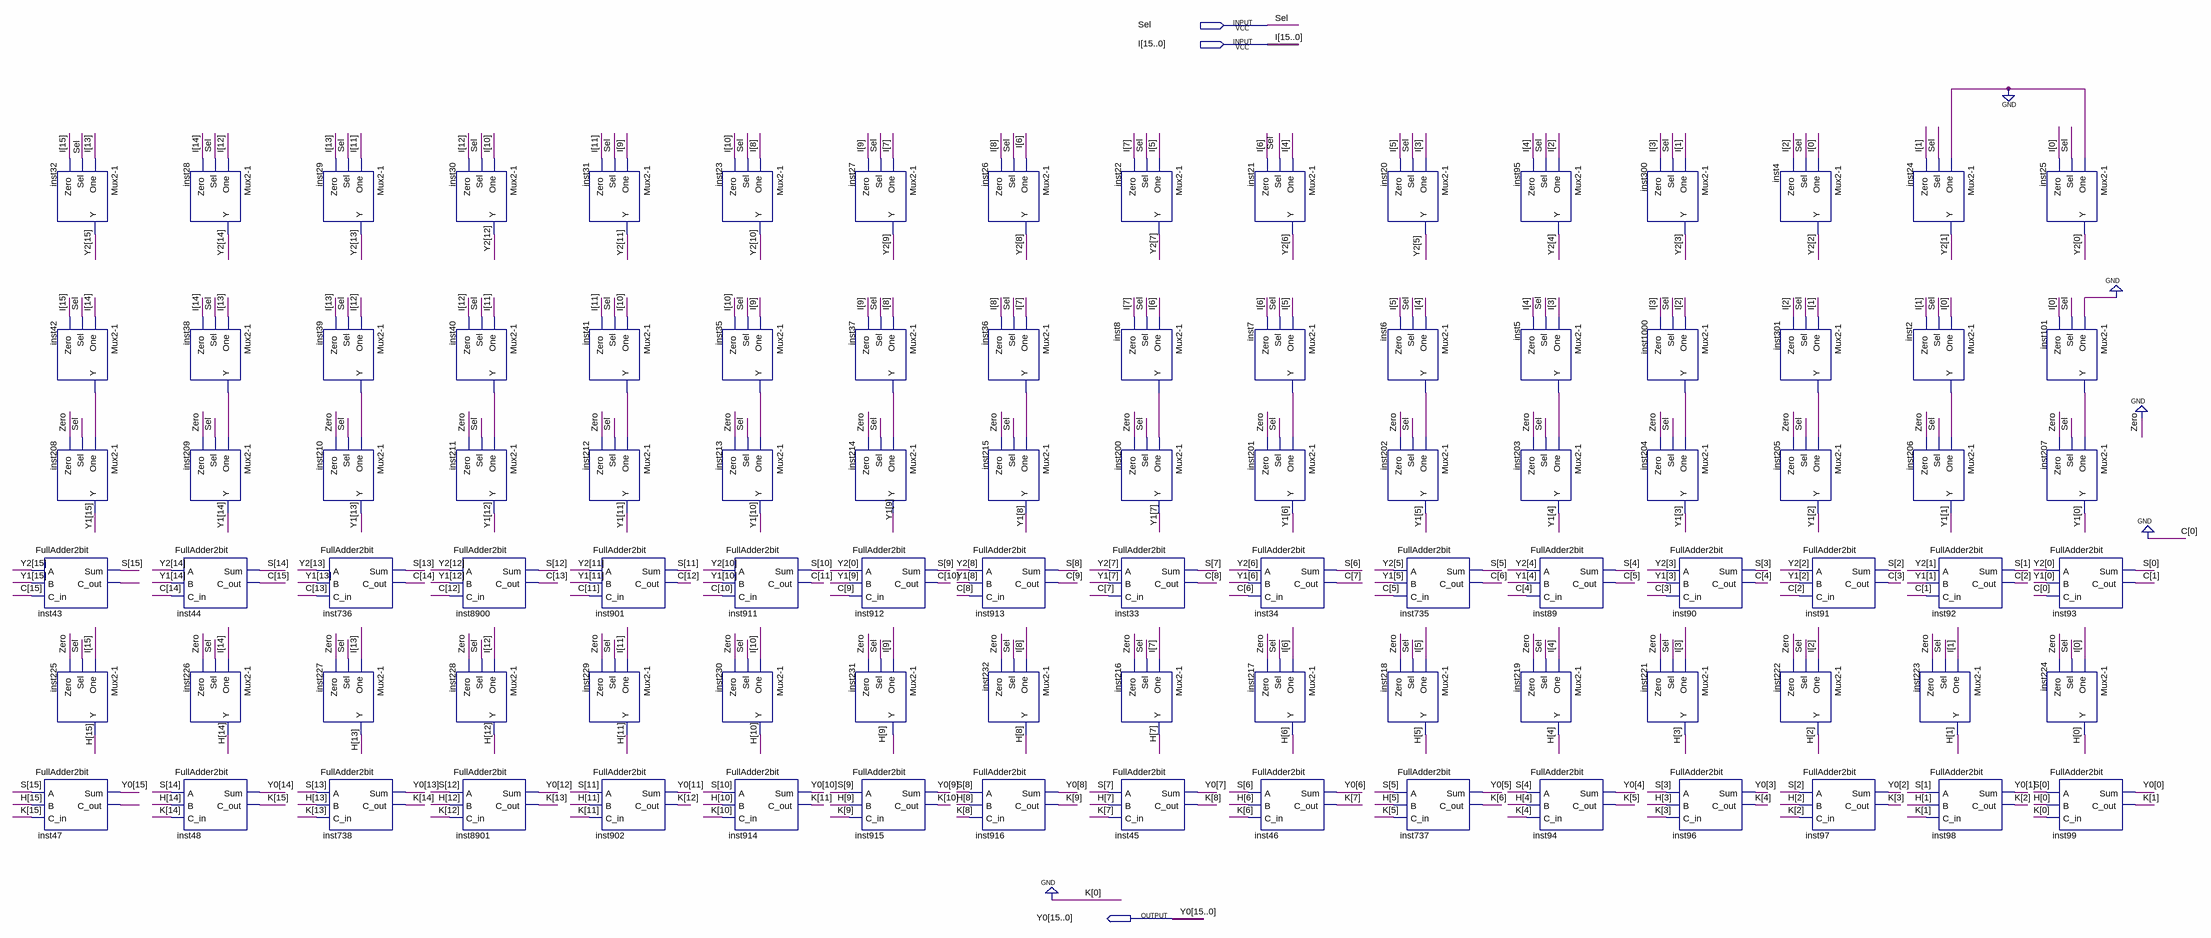
[diagram p0: schematic sheet]
// Quartus schematic ShifterX7.bdf as structural Verilog: 96 symbols, 3 pins
module ShifterX7 (
  input  Sel,
  input  [15:0] I,
  output [15:0] Y0
);

  wire inst2_y, inst5_y, inst6_y, inst7_y, inst8_y, inst35_y, inst36_y, inst37_y, inst38_y, inst39_y,
       inst40_y, inst41_y, inst42_y, inst43_c_out, inst47_c_out, inst101_y, inst301_y, inst1000_y;
  wire [15:0] H, S, Y1, Y2;
  wire [15:1] C, K;

  FullAdder2bit inst43 (.A(Y2[15]), .B(Y1[15]), .C_in(C[15]), .Sum(S[15]), .C_out(inst43_c_out));
  FullAdder2bit inst47 (.A(S[15]), .B(H[15]), .C_in(K[15]), .Sum(Y0[15]), .C_out(inst47_c_out));
  \Mux2-1  inst32 (.One(I[13]), .Sel(Sel), .Zero(I[15]), .Y(Y2[15]));
  \Mux2-1  inst42 (.One(I[14]), .Sel(Sel), .Zero(I[15]), .Y(inst42_y));
  \Mux2-1  inst208 (.One(inst42_y), .Sel(Sel), .Zero(1'b0), .Y(Y1[15]));
  \Mux2-1  inst225 (.One(I[15]), .Sel(Sel), .Zero(1'b0), .Y(H[15]));
  \Mux2-1  inst28 (.One(I[12]), .Sel(Sel), .Zero(I[14]), .Y(Y2[14]));
  \Mux2-1  inst38 (.One(I[13]), .Sel(Sel), .Zero(I[14]), .Y(inst38_y));
  \Mux2-1  inst209 (.One(inst38_y), .Sel(Sel), .Zero(1'b0), .Y(Y1[14]));
  FullAdder2bit inst44 (.A(Y2[14]), .B(Y1[14]), .C_in(C[14]), .Sum(S[14]), .C_out(C[15]));
  \Mux2-1  inst226 (.One(I[14]), .Sel(Sel), .Zero(1'b0), .Y(H[14]));
  FullAdder2bit inst48 (.A(S[14]), .B(H[14]), .C_in(K[14]), .Sum(Y0[14]), .C_out(K[15]));
  \Mux2-1  inst29 (.One(I[11]), .Sel(Sel), .Zero(I[13]), .Y(Y2[13]));
  \Mux2-1  inst39 (.One(I[12]), .Sel(Sel), .Zero(I[13]), .Y(inst39_y));
  \Mux2-1  inst210 (.One(inst39_y), .Sel(Sel), .Zero(1'b0), .Y(Y1[13]));
  FullAdder2bit inst736 (.A(Y2[13]), .B(Y1[13]), .C_in(C[13]), .Sum(S[13]), .C_out(C[14]));
  \Mux2-1  inst227 (.One(I[13]), .Sel(Sel), .Zero(1'b0), .Y(H[13]));
  FullAdder2bit inst738 (.A(S[13]), .B(H[13]), .C_in(K[13]), .Sum(Y0[13]), .C_out(K[14]));
  \Mux2-1  inst30 (.One(I[10]), .Sel(Sel), .Zero(I[12]), .Y(Y2[12]));
  \Mux2-1  inst40 (.One(I[11]), .Sel(Sel), .Zero(I[12]), .Y(inst40_y));
  \Mux2-1  inst211 (.One(inst40_y), .Sel(Sel), .Zero(1'b0), .Y(Y1[12]));
  FullAdder2bit inst8900 (.A(Y2[12]), .B(Y1[12]), .C_in(C[12]), .Sum(S[12]), .C_out(C[13]));
  \Mux2-1  inst228 (.One(I[12]), .Sel(Sel), .Zero(1'b0), .Y(H[12]));
  FullAdder2bit inst8901 (.A(S[12]), .B(H[12]), .C_in(K[12]), .Sum(Y0[12]), .C_out(K[13]));
  \Mux2-1  inst31 (.One(I[9]), .Sel(Sel), .Zero(I[11]), .Y(Y2[11]));
  \Mux2-1  inst41 (.One(I[10]), .Sel(Sel), .Zero(I[11]), .Y(inst41_y));
  \Mux2-1  inst212 (.One(inst41_y), .Sel(Sel), .Zero(1'b0), .Y(Y1[11]));
  FullAdder2bit inst901 (.A(Y2[11]), .B(Y1[11]), .C_in(C[11]), .Sum(S[11]), .C_out(C[12]));
  \Mux2-1  inst229 (.One(I[11]), .Sel(Sel), .Zero(1'b0), .Y(H[11]));
  FullAdder2bit inst902 (.A(S[11]), .B(H[11]), .C_in(K[11]), .Sum(Y0[11]), .C_out(K[12]));
  \Mux2-1  inst23 (.One(I[8]), .Sel(Sel), .Zero(I[10]), .Y(Y2[10]));
  \Mux2-1  inst35 (.One(I[9]), .Sel(Sel), .Zero(I[10]), .Y(inst35_y));
  \Mux2-1  inst213 (.One(inst35_y), .Sel(Sel), .Zero(1'b0), .Y(Y1[10]));
  FullAdder2bit inst911 (.A(Y2[10]), .B(Y1[10]), .C_in(C[10]), .Sum(S[10]), .C_out(C[11]));
  \Mux2-1  inst230 (.One(I[10]), .Sel(Sel), .Zero(1'b0), .Y(H[10]));
  FullAdder2bit inst914 (.A(S[10]), .B(H[10]), .C_in(K[10]), .Sum(Y0[10]), .C_out(K[11]));
  \Mux2-1  inst27 (.One(I[7]), .Sel(Sel), .Zero(I[9]), .Y(Y2[9]));
  \Mux2-1  inst37 (.One(I[8]), .Sel(Sel), .Zero(I[9]), .Y(inst37_y));
  \Mux2-1  inst214 (.One(inst37_y), .Sel(Sel), .Zero(1'b0), .Y(Y1[9]));
  \Mux2-1  inst231 (.One(I[9]), .Sel(Sel), .Zero(1'b0), .Y(H[9]));
  FullAdder2bit inst912 (.A(Y2[0]), .B(Y1[9]), .C_in(C[9]), .Sum(S[9]), .C_out(C[10]));
  FullAdder2bit inst915 (.A(S[9]), .B(H[9]), .C_in(K[9]), .Sum(Y0[9]), .C_out(K[10]));
  \Mux2-1  inst26 (.One(I[6]), .Sel(Sel), .Zero(I[8]), .Y(Y2[8]));
  \Mux2-1  inst36 (.One(I[7]), .Sel(Sel), .Zero(I[8]), .Y(inst36_y));
  \Mux2-1  inst215 (.One(inst36_y), .Sel(Sel), .Zero(1'b0), .Y(Y1[8]));
  FullAdder2bit inst913 (.A(Y2[8]), .B(Y1[8]), .C_in(C[8]), .Sum(S[8]), .C_out(C[9]));
  \Mux2-1  inst232 (.One(I[8]), .Sel(Sel), .Zero(1'b0), .Y(H[8]));
  FullAdder2bit inst916 (.A(S[8]), .B(H[8]), .C_in(K[8]), .Sum(Y0[8]), .C_out(K[9]));
  \Mux2-1  inst22 (.One(I[5]), .Sel(Sel), .Zero(I[7]), .Y(Y2[7]));
  \Mux2-1  inst8 (.One(I[6]), .Sel(Sel), .Zero(I[7]), .Y(inst8_y));
  \Mux2-1  inst200 (.One(inst8_y), .Sel(Sel), .Zero(1'b0), .Y(Y1[7]));
  FullAdder2bit inst33 (.A(Y2[7]), .B(Y1[7]), .C_in(C[7]), .Sum(S[7]), .C_out(C[8]));
  \Mux2-1  inst216 (.One(I[7]), .Sel(Sel), .Zero(1'b0), .Y(H[7]));
  FullAdder2bit inst45 (.A(S[7]), .B(H[7]), .C_in(K[7]), .Sum(Y0[7]), .C_out(K[8]));
  \Mux2-1  inst21 (.One(I[4]), .Sel(Sel), .Zero(I[6]), .Y(Y2[6]));
  \Mux2-1  inst7 (.One(I[5]), .Sel(Sel), .Zero(I[6]), .Y(inst7_y));
  \Mux2-1  inst201 (.One(inst7_y), .Sel(Sel), .Zero(1'b0), .Y(Y1[6]));
  FullAdder2bit inst34 (.A(Y2[6]), .B(Y1[6]), .C_in(C[6]), .Sum(S[6]), .C_out(C[7]));
  \Mux2-1  inst217 (.One(I[6]), .Sel(Sel), .Zero(1'b0), .Y(H[6]));
  FullAdder2bit inst46 (.A(S[6]), .B(H[6]), .C_in(K[6]), .Sum(Y0[6]), .C_out(K[7]));
  \Mux2-1  inst20 (.One(I[3]), .Sel(Sel), .Zero(I[5]), .Y(Y2[5]));
  \Mux2-1  inst6 (.One(I[4]), .Sel(Sel), .Zero(I[5]), .Y(inst6_y));
  \Mux2-1  inst202 (.One(inst6_y), .Sel(Sel), .Zero(1'b0), .Y(Y1[5]));
  FullAdder2bit inst735 (.A(Y2[5]), .B(Y1[5]), .C_in(C[5]), .Sum(S[5]), .C_out(C[6]));
  \Mux2-1  inst218 (.One(I[5]), .Sel(Sel), .Zero(1'b0), .Y(H[5]));
  FullAdder2bit inst737 (.A(S[5]), .B(H[5]), .C_in(K[5]), .Sum(Y0[5]), .C_out(K[6]));
  \Mux2-1  inst95 (.One(I[2]), .Sel(Sel), .Zero(I[4]), .Y(Y2[4]));
  \Mux2-1  inst5 (.One(I[3]), .Sel(Sel), .Zero(I[4]), .Y(inst5_y));
  \Mux2-1  inst203 (.One(inst5_y), .Sel(Sel), .Zero(1'b0), .Y(Y1[4]));
  FullAdder2bit inst89 (.A(Y2[4]), .B(Y1[4]), .C_in(C[4]), .Sum(S[4]), .C_out(C[5]));
  \Mux2-1  inst219 (.One(I[4]), .Sel(Sel), .Zero(1'b0), .Y(H[4]));
  FullAdder2bit inst94 (.A(S[4]), .B(H[4]), .C_in(K[4]), .Sum(Y0[4]), .C_out(K[5]));
  \Mux2-1  inst300 (.One(I[1]), .Sel(Sel), .Zero(I[3]), .Y(Y2[3]));
  \Mux2-1  inst1000 (.One(I[2]), .Sel(Sel), .Zero(I[3]), .Y(inst1000_y));
  \Mux2-1  inst204 (.One(inst1000_y), .Sel(Sel), .Zero(1'b0), .Y(Y1[3]));
  \Mux2-1  inst221 (.One(I[3]), .Sel(Sel), .Zero(1'b0), .Y(H[3]));
  FullAdder2bit inst90 (.A(Y2[3]), .B(Y1[3]), .C_in(C[3]), .Sum(S[3]), .C_out(C[4]));
  FullAdder2bit inst96 (.A(S[3]), .B(H[3]), .C_in(K[3]), .Sum(Y0[3]), .C_out(K[4]));
  \Mux2-1  inst4 (.One(I[0]), .Sel(Sel), .Zero(I[2]), .Y(Y2[2]));
  \Mux2-1  inst301 (.One(I[1]), .Sel(Sel), .Zero(I[2]), .Y(inst301_y));
  \Mux2-1  inst205 (.One(inst301_y), .Sel(Sel), .Zero(1'b0), .Y(Y1[2]));
  FullAdder2bit inst91 (.A(Y2[2]), .B(Y1[2]), .C_in(C[2]), .Sum(S[2]), .C_out(C[3]));
  \Mux2-1  inst222 (.One(I[2]), .Sel(Sel), .Zero(1'b0), .Y(H[2]));
  FullAdder2bit inst97 (.A(S[2]), .B(H[2]), .C_in(K[2]), .Sum(Y0[2]), .C_out(K[3]));
  \Mux2-1  inst24 (.One(1'b0), .Sel(Sel), .Zero(I[1]), .Y(Y2[1]));
  \Mux2-1  inst2 (.One(I[0]), .Sel(Sel), .Zero(I[1]), .Y(inst2_y));
  \Mux2-1  inst206 (.One(inst2_y), .Sel(Sel), .Zero(1'b0), .Y(Y1[1]));
  \Mux2-1  inst223 (.One(I[1]), .Sel(Sel), .Zero(1'b0), .Y(H[1]));
  FullAdder2bit inst92 (.A(Y2[1]), .B(Y1[1]), .C_in(C[1]), .Sum(S[1]), .C_out(C[2]));
  FullAdder2bit inst98 (.A(S[1]), .B(H[1]), .C_in(K[1]), .Sum(Y0[1]), .C_out(K[2]));
  \Mux2-1  inst25 (.One(1'b0), .Sel(Sel), .Zero(I[0]), .Y(Y2[0]));
  \Mux2-1  inst101 (.One(1'b0), .Sel(Sel), .Zero(I[0]), .Y(inst101_y));
  \Mux2-1  inst207 (.One(inst101_y), .Sel(Sel), .Zero(1'b0), .Y(Y1[0]));
  FullAdder2bit inst93 (.A(Y2[0]), .B(Y1[0]), .C_in(1'b0), .Sum(S[0]), .C_out(C[1]));
  \Mux2-1  inst224 (.One(I[0]), .Sel(Sel), .Zero(1'b0), .Y(H[0]));
  FullAdder2bit inst99 (.A(S[0]), .B(H[0]), .C_in(1'b0), .Sum(Y0[0]), .C_out(K[1]));
endmodule
